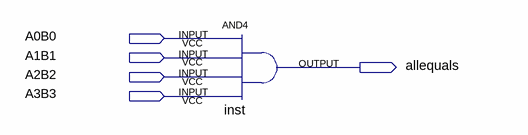
[diagram p0: schematic sheet]
// Quartus schematic IgualdadeComp.bdf as structural Verilog: 1 symbols, 5 pins
module IgualdadeComp (
  input  A0B0,
  input  A1B1,
  input  A2B2,
  input  A3B3,
  output allequals
);

  and inst (allequals, A0B0, A1B1, A2B2, A3B3);
endmodule
